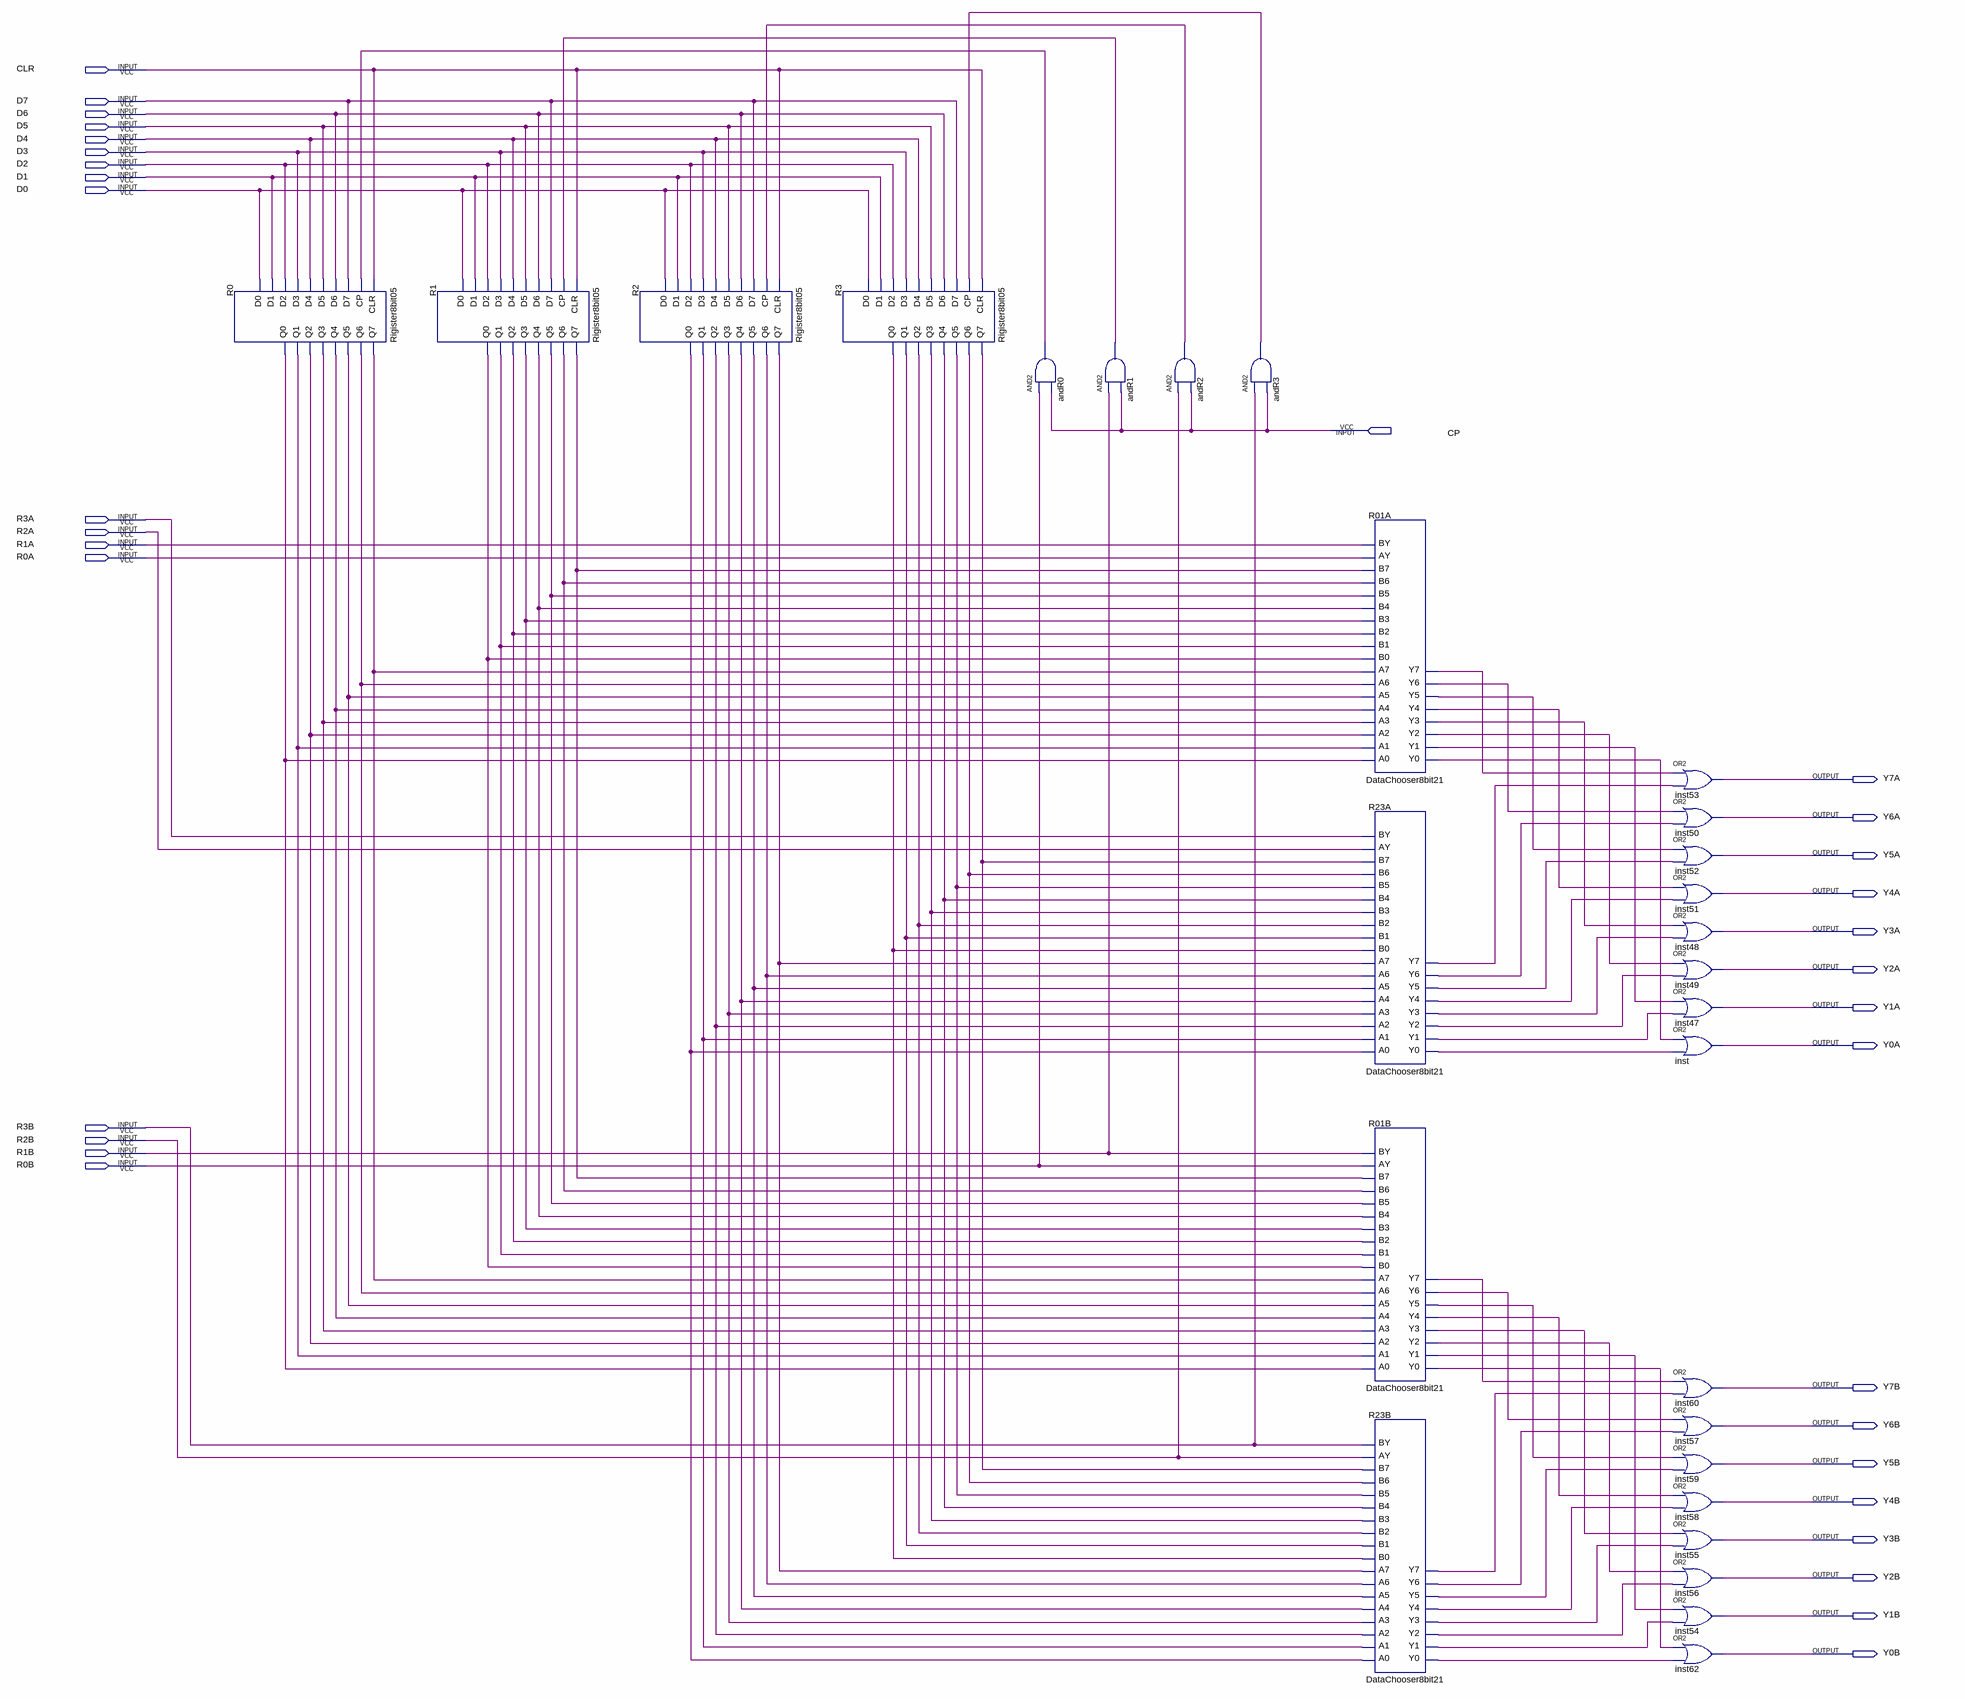
[diagram p0: schematic sheet]
// Quartus schematic RigisterGroup.bdf as structural Verilog: 28 symbols, 34 pins
module RigisterGroup (
  input  CLR,
  input  D7,
  input  D6,
  input  D5,
  input  D4,
  input  D3,
  input  D2,
  input  D1,
  input  D0,
  input  CP,
  input  R3A,
  input  R2A,
  input  R1A,
  input  R0A,
  input  R3B,
  input  R2B,
  input  R1B,
  input  R0B,
  output Y7A,
  output Y6A,
  output Y5A,
  output Y4A,
  output Y3A,
  output Y2A,
  output Y1A,
  output Y0A,
  output Y7B,
  output Y6B,
  output Y5B,
  output Y4B,
  output Y3B,
  output Y2B,
  output Y1B,
  output Y0B
);

  wire andR0_out, andR1_out, andR2_out, andR3_out, R0_q0, R0_q1, R0_q2, R0_q3, R0_q4, R0_q5, R0_q6, R0_q7,
       R1_q0, R1_q1, R1_q2, R1_q3, R1_q4, R1_q5, R1_q6, R1_q7, R01A_y0, R01A_y1, R01A_y2, R01A_y3, R01A_y4,
       R01A_y5, R01A_y6, R01A_y7, R01B_y0, R01B_y1, R01B_y2, R01B_y3, R01B_y4, R01B_y5, R01B_y6, R01B_y7,
       R2_q0, R2_q1, R2_q2, R2_q3, R2_q4, R2_q5, R2_q6, R2_q7, R3_q0, R3_q1, R3_q2, R3_q3, R3_q4, R3_q5,
       R3_q6, R3_q7, R23A_y0, R23A_y1, R23A_y2, R23A_y3, R23A_y4, R23A_y5, R23A_y6, R23A_y7, R23B_y0,
       R23B_y1, R23B_y2, R23B_y3, R23B_y4, R23B_y5, R23B_y6, R23B_y7;

  Rigister8bit05 R0 (
    .CLR(CLR), .CP(andR0_out), .D7(D7), .D6(D6), .D5(D5), .D4(D4), .D3(D3), .D2(D2), .D1(D1), .D0(D0),
    .Q7(R0_q7), .Q6(R0_q6), .Q5(R0_q5), .Q4(R0_q4), .Q3(R0_q3), .Q2(R0_q2), .Q1(R0_q1), .Q0(R0_q0));
  Rigister8bit05 R1 (
    .CLR(CLR), .CP(andR1_out), .D7(D7), .D6(D6), .D5(D5), .D4(D4), .D3(D3), .D2(D2), .D1(D1), .D0(D0),
    .Q7(R1_q7), .Q6(R1_q6), .Q5(R1_q5), .Q4(R1_q4), .Q3(R1_q3), .Q2(R1_q2), .Q1(R1_q1), .Q0(R1_q0));
  Rigister8bit05 R2 (
    .CLR(CLR), .CP(andR2_out), .D7(D7), .D6(D6), .D5(D5), .D4(D4), .D3(D3), .D2(D2), .D1(D1), .D0(D0),
    .Q7(R2_q7), .Q6(R2_q6), .Q5(R2_q5), .Q4(R2_q4), .Q3(R2_q3), .Q2(R2_q2), .Q1(R2_q1), .Q0(R2_q0));
  Rigister8bit05 R3 (
    .CLR(CLR), .CP(andR3_out), .D7(D7), .D6(D6), .D5(D5), .D4(D4), .D3(D3), .D2(D2), .D1(D1), .D0(D0),
    .Q7(R3_q7), .Q6(R3_q6), .Q5(R3_q5), .Q4(R3_q4), .Q3(R3_q3), .Q2(R3_q2), .Q1(R3_q1), .Q0(R3_q0));
  and andR0 (andR0_out, R0B, CP);
  and andR1 (andR1_out, R1B, CP);
  and andR2 (andR2_out, R2B, CP);
  and andR3 (andR3_out, R3B, CP);
  DataChooser8bit21 R01A (
    .A0(R0_q0), .A1(R0_q1), .A2(R0_q2), .A3(R0_q3), .A4(R0_q4), .A5(R0_q5), .A6(R0_q6), .A7(R0_q7),
    .B0(R1_q0), .B1(R1_q1), .B2(R1_q2), .B3(R1_q3), .B4(R1_q4), .B5(R1_q5), .B6(R1_q6), .B7(R1_q7), .AY(R0A),
    .BY(R1A), .Y0(R01A_y0), .Y1(R01A_y1), .Y2(R01A_y2), .Y3(R01A_y3), .Y4(R01A_y4), .Y5(R01A_y5),
    .Y6(R01A_y6), .Y7(R01A_y7));
  DataChooser8bit21 R23A (
    .A0(R2_q0), .A1(R2_q1), .A2(R2_q2), .A3(R2_q3), .A4(R2_q4), .A5(R2_q5), .A6(R2_q6), .A7(R2_q7),
    .B0(R3_q0), .B1(R3_q1), .B2(R3_q2), .B3(R3_q3), .B4(R3_q4), .B5(R3_q5), .B6(R3_q6), .B7(R3_q7), .AY(R2A),
    .BY(R3A), .Y0(R23A_y0), .Y1(R23A_y1), .Y2(R23A_y2), .Y3(R23A_y3), .Y4(R23A_y4), .Y5(R23A_y5),
    .Y6(R23A_y6), .Y7(R23A_y7));
  DataChooser8bit21 R01B (
    .A0(R0_q0), .A1(R0_q1), .A2(R0_q2), .A3(R0_q3), .A4(R0_q4), .A5(R0_q5), .A6(R0_q6), .A7(R0_q7),
    .B0(R1_q0), .B1(R1_q1), .B2(R1_q2), .B3(R1_q3), .B4(R1_q4), .B5(R1_q5), .B6(R1_q6), .B7(R1_q7), .AY(R0B),
    .BY(R1B), .Y0(R01B_y0), .Y1(R01B_y1), .Y2(R01B_y2), .Y3(R01B_y3), .Y4(R01B_y4), .Y5(R01B_y5),
    .Y6(R01B_y6), .Y7(R01B_y7));
  DataChooser8bit21 R23B (
    .A0(R2_q0), .A1(R2_q1), .A2(R2_q2), .A3(R2_q3), .A4(R2_q4), .A5(R2_q5), .A6(R2_q6), .A7(R2_q7),
    .B0(R3_q0), .B1(R3_q1), .B2(R3_q2), .B3(R3_q3), .B4(R3_q4), .B5(R3_q5), .B6(R3_q6), .B7(R3_q7), .AY(R2B),
    .BY(R3B), .Y0(R23B_y0), .Y1(R23B_y1), .Y2(R23B_y2), .Y3(R23B_y3), .Y4(R23B_y4), .Y5(R23B_y5),
    .Y6(R23B_y6), .Y7(R23B_y7));
  or inst53 (Y7A, R01A_y7, R23A_y7);
  or inst50 (Y6A, R01A_y6, R23A_y6);
  or inst52 (Y5A, R01A_y5, R23A_y5);
  or inst51 (Y4A, R01A_y4, R23A_y4);
  or inst48 (Y3A, R01A_y3, R23A_y3);
  or inst49 (Y2A, R01A_y2, R23A_y2);
  or inst47 (Y1A, R01A_y1, R23A_y1);
  or inst (Y0A, R01A_y0, R23A_y0);
  or inst60 (Y7B, R01B_y7, R23B_y7);
  or inst57 (Y6B, R01B_y6, R23B_y6);
  or inst59 (Y5B, R01B_y5, R23B_y5);
  or inst58 (Y4B, R01B_y4, R23B_y4);
  or inst55 (Y3B, R01B_y3, R23B_y3);
  or inst56 (Y2B, R01B_y2, R23B_y2);
  or inst54 (Y1B, R01B_y1, R23B_y1);
  or inst62 (Y0B, R01B_y0, R23B_y0);
endmodule
